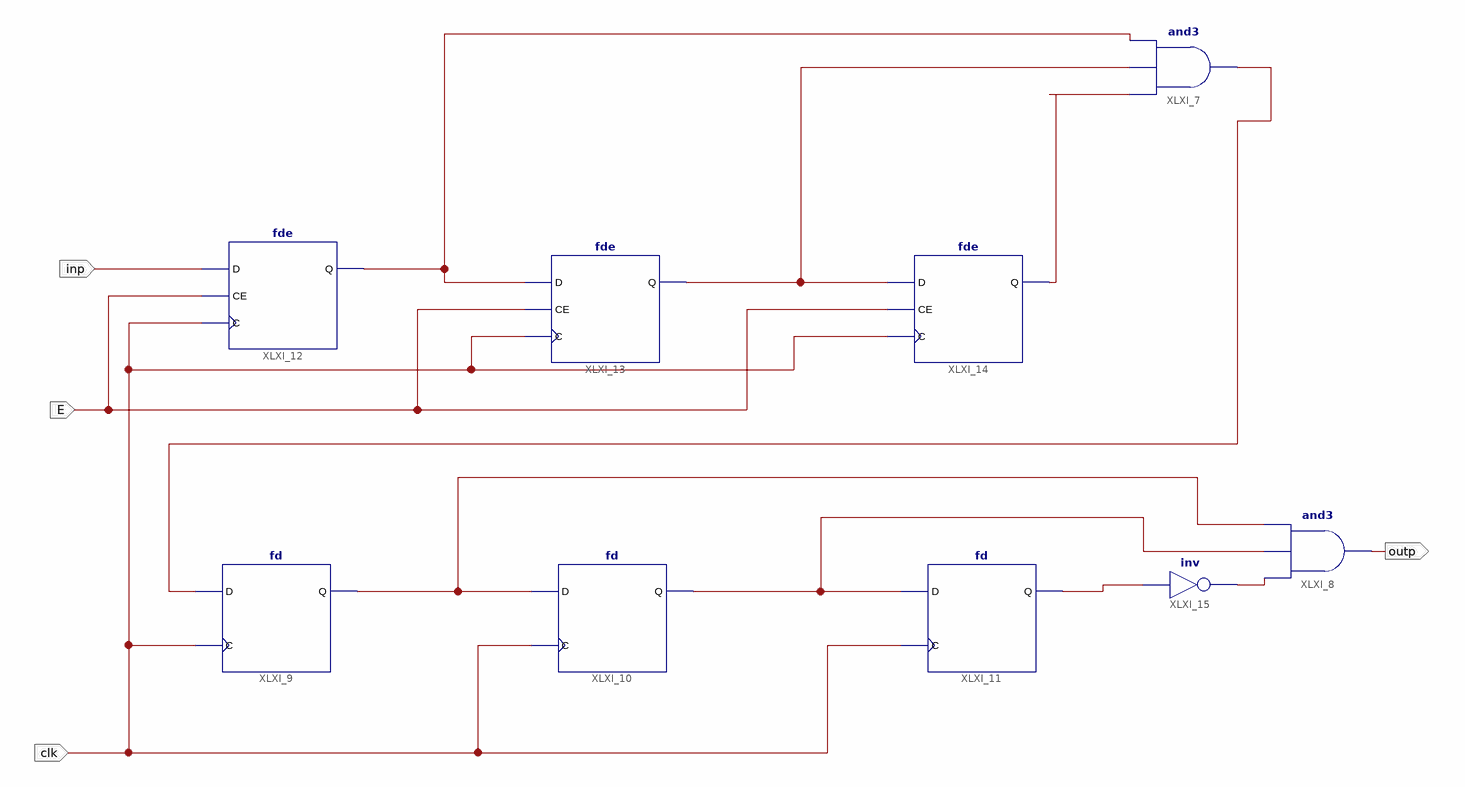
[diagram p0: schematic sheet 1]
// Xilinx ISE schematic pulse.sch (spartan6) as structural Verilog: 9 symbols, 4 ports
module pulse (
  input  clk,
  input  E,
  input  inp,
  output outp
);

  wire XLXN_9, XLXN_10, XLXN_11, XLXN_12, XLXN_14, XLXN_16, XLXN_17, XLXN_18;

  and XLXI_7 (XLXN_12, XLXN_11, XLXN_10, XLXN_9);
  and XLXI_8 (outp, XLXN_18, XLXN_14, XLXN_16);
  fd XLXI_9 (.C(clk), .D(XLXN_12), .Q(XLXN_16));
  fd XLXI_10 (.C(clk), .D(XLXN_16), .Q(XLXN_14));
  fd XLXI_11 (.C(clk), .D(XLXN_14), .Q(XLXN_17));
  fde XLXI_12 (.C(clk), .CE(E), .D(inp), .Q(XLXN_9));
  fde XLXI_13 (.C(clk), .CE(E), .D(XLXN_9), .Q(XLXN_10));
  fde XLXI_14 (.C(clk), .CE(E), .D(XLXN_10), .Q(XLXN_11));
  not XLXI_15 (XLXN_18, XLXN_17);
endmodule
